# Altium schematic sheet Mestrado_Roger.SchDoc
size A4; SheetNumber: 1; SheetTotal: 1
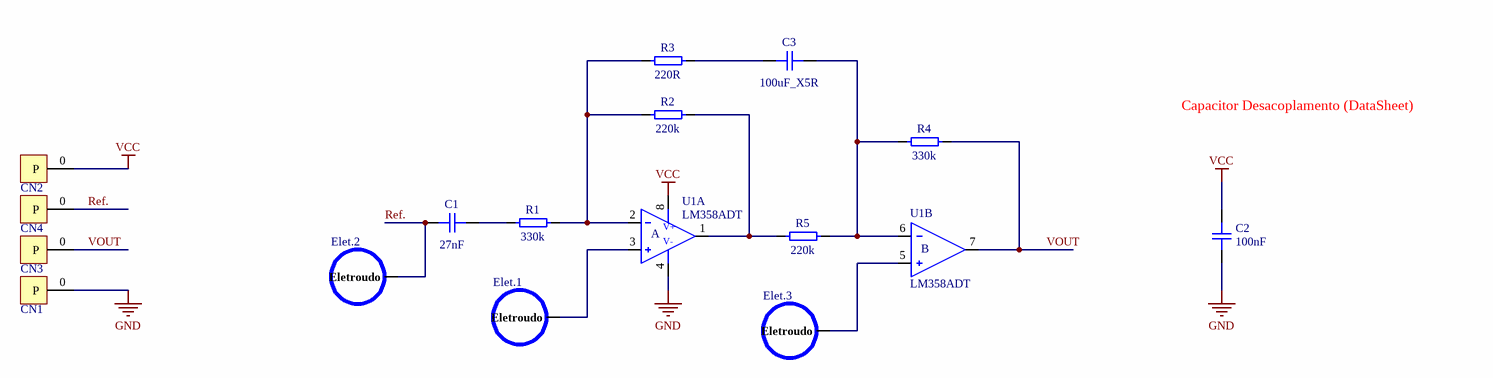
[diagram p0: Mestrado_Roger.SchDoc]

## Parts
C1  27nF  [SMD_C_0603]
C2  100nF  [SMD_C_0603]
C3  100uF_X5R  [SMD_C_0805]
CN1  Pad  [Pad]  (value not drawn)  (no BOM)
CN2  Pad  [Pad]  (value not drawn)  (no BOM)
CN3  Pad  [Pad]  (value not drawn)  (no BOM)
CN4  Pad  [Pad]  (value not drawn)  (no BOM)
Elet.1  Circuito_Eletroudo  [Eletroudo]  (value not drawn)
Elet.2  Circuito_Eletroudo  [Eletroudo]  (value not drawn)
Elet.3  Circuito_Eletroudo  [Eletroudo]  (value not drawn)
R1  330k  [SMD_R0603_F]
R2  220k  [SMD_R0603_F]
R3  220R  [SMD_R0603_F]
R4  330k  [SMD_R0603_F]
R5  220k  [SMD_R0603_F]
U1  LM358ADT  [SOIC-8]  (parts A,B of 2)

## Nets
GND: C2.2 CN1.0(P) U1.4(GND)
VCC: C2.1 CN2.0(P) U1.8(VCC)
Ref.: C1.1 CN4.0(P) Elet.2.0(Eletroudo)
VOUT: CN3.0(P) R4.1 U1.7(OUT2)
NetC1_2: C1.2 R1.1
NetC3_1: C3.1 R3.2
NetC3_2: C3.2 R4.2 R5.2 U1.6(IN2(-))
NetElet.1_0: Elet.1.0(Eletroudo) U1.3(IN1(+))
NetElet.3_0: Elet.3.0(Eletroudo) U1.5(IN2(+))
NetR1_2: R1.2 R2.1 R3.1 U1.2(IN1(-))
NetR2_2: R2.2 R5.1 U1.1(OUT1)

## Notes on the sheet
- Capacitor Desacoplamento (DataSheet)
- WF TECNOLOGIA
- Projeto de PCB's
- +55 41 99558-4388
- eng.figueiredo@outlook.com.br
- Revisão
- Data
- Respons.
- Histórico
- Esquemático
- Projeto
- Elaboração
- Horário
- Aprovação
- Tamanho
- Folha
- Layout
- A3
- /
- Arquivo
- (in symbol Amp_LM358ADT, part A) V+; A; V-
- (in symbol Amp_LM358ADT, part B) B

## Library data of the parts
C1 = Cap_Cer._0.027uF_10%_25V_SMD(0603): 0.027 µF ±10% 25V Ceramic Capacitor X7R 0603 (1608 Metric); Part Number: GMC10X7R273K25NT; Manufacturer: Cal-Chip Electronics, Inc.; Type: SMD; Value: 27nF; Supplier Part Number 1: 2571-GMC10X7R273K25NTTR-ND; Supplier 1: Digi-Key; Size: 0603; ComponentLink1Description: Datasheet 1; ComponentLink1URL: https://calchip.com/wp-content/uploads/2023/09/GMC-Series-2.pdf
C2 = Cap_Cer._100nF_10%_50V_SMD(0603): 0.1 µF ±10% 50V Ceramic Capacitor X7R 0603 (1608 Metric); Part Number: C1608X7R1H104K080AA; Manufacturer: TDK Corporation; Type: SMD; CDM: C10416; Value: 100nF; Supplier Part Number 1: 445-1314-2-ND; Supplier 1: Digi-Key; Size: 0603; ComponentLink1Description: Datasheet 1; ComponentLink1URL: https://product.tdk.com/system/files/dam/doc/product/capacitor/ceramic/mlcc/catalog/mlcc_commercial_general_en.pdf
C3 = Cap_Cer._100uF_20%_4V_SMD(0805): 100 µF ±20% 4V Ceramic Capacitor X5R 0805 (2012 Metric); Part Number: GRM21BR60G107ME11L; Manufacturer: Murata Electronics; Type: SMD; Value: 100uF_X5R; Supplier Part Number 1: 490-13980-2-ND; Supplier 1: Digi-Key; Size: 0805; ComponentLink1Description: Datasheet 1; ComponentLink1URL: https://search.murata.co.jp/Ceramy/image/img/A01X/G101/ENG/GRM21BR60G107ME11-01.pdf
R1 R4 = RES_330k_1%_0.1W_SMD(0603): 330 kOhms ±1% 0.1W, 1/10W Chip Resistor 0603 (1608 Metric) Moisture Resistant Thick Film; Part Number: RC0603FR-07330KL; Manufacturer: YAGEO; CDM: C12147; Value: 330k; Supplier Part Number 1: 311-330KHRTR-ND; Supplier 1: Digi-Key; Size: 0603; Type: SMD; ComponentLink1Description: DataSheet; ComponentLink1URL: https://www.yageo.com/upload/media/product/app/datasheet/rchip/pyu-rc_group_51_rohs_l.pdf
R2 R5 = RES_220k_1%_0.1W_SMD(0603): 220 kOhms ±1% 0.1W, 1/10W Chip Resistor 0603 (1608 Metric) Moisture Resistant Thick Film; Part Number: RC0603FR-07220KL; Manufacturer: YAGEO; CDM: C10444; Value: 220k; Supplier Part Number 1: 311-220KHRTR-ND; Supplier 1: Digi-Key; Size: 0603; Type: SMD; ComponentLink1Description: DataSheet; ComponentLink1URL: https://www.yageo.com/upload/media/product/app/datasheet/rchip/pyu-rc_group_51_rohs_l.pdf
R3 = RES_220R_1%_0.1W_SMD(0603): 220 Ohms ±1% 0.1W, 1/10W Chip Resistor 0603 (1608 Metric) Moisture Resistant Thick Film; Part Number: RC0603FR-07220RL; Manufacturer: YAGEO; CDM: C10420; Value: 220R; Supplier Part Number 1: 311-220HRTR-ND; Supplier 1: Digi-Key; Size: 0603; Type: SMD; ComponentLink1Description: DataSheet; ComponentLink1URL: https://www.yageo.com/upload/media/product/productsearch/datasheet/rchip/PYu-RC_Group_51_RoHS_L_12.pdf
U1 = Amp_LM358ADT: Uso geral Amplificador 2 Circuito 8-SOIC; Manufacturer: STMicroelectronics; CDM: C12452; Value: LM358ADT; Supplier Part Number 1: 497-1590-2-ND; Supplier 1: Digi-Key; Size: SOIC-8; Type: SMD; ComponentLink1Description: Datasheet 1; ComponentLink1URL: https://www.st.com/content/ccc/resource/technical/document/datasheet/61/46/87/01/98/ed/44/c5/CD00000464.pdf/files/CD00000464.pdf/jcr:content/translations/en.CD00000464.pdf; Part Number: LM358ADT